# EAGLE design FTDI 1.1 (EAGLE 6.2)
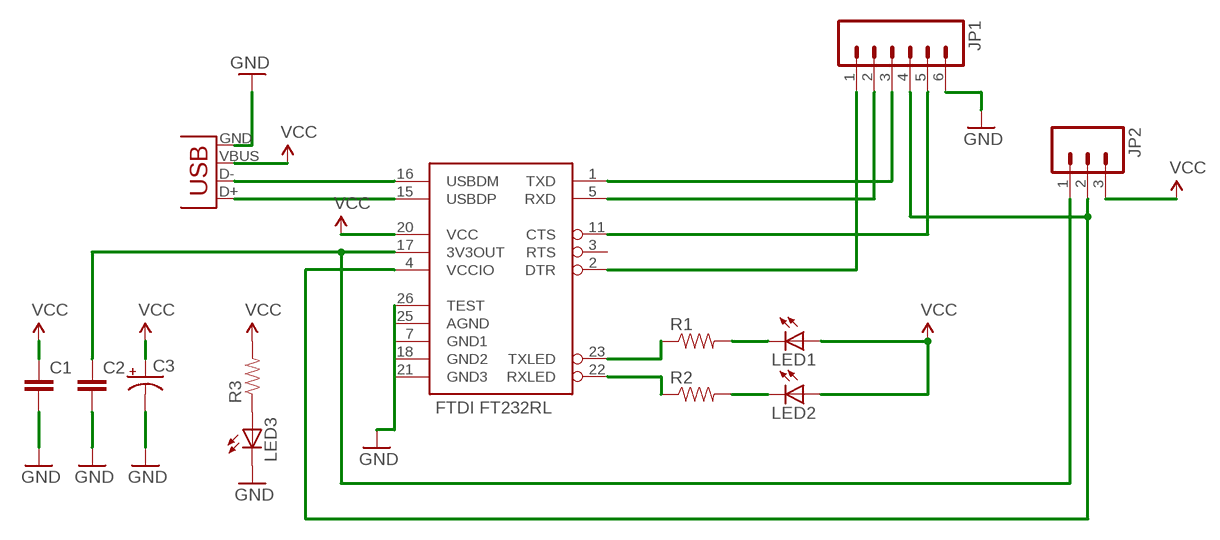
[diagram p0: schematic, sheet 1]

## Parts
C1  CAP0603-CAP  [0603-CAP]
C2  CAP0603-CAP  [0603-CAP]
C3  CAP_POL1206  [EIA3216]
JP1  M06SIP  [1X06]
JP2  M03PTH  [1X03]
LED1  LED0603  [LED-0603]
LED2  LED0603  [LED-0603]
LED3  LED0603  [LED-0603]
R1  RESISTOR0603-RES  [0603-RES]
R2  RESISTOR0603-RES  [0603-RES]
R3  RESISTOR0603-RES  [0603-RES]
U1  FT232RL-BASICSSOP  [SSOP28DB]
X1  USB-SMD-NS  [USB-MINIB-NOSTOP]

## Nets
GND: C1.2 C2.2 C3.C(-) JP1.6 LED3.C U1.7(GND1) U1.18(GND2) U1.21(GND3) U1.25(AGND) U1.26(TEST) X1.GND
N$1: U1.16(USBDM) X1.D-
N$2: R1.1 U1.23(TXLED)
N$3: LED1.C R1.2
N$4: LED2.C R2.2
N$5: R2.1 U1.22(RXLED)
N$6: U1.15(USBDP) X1.D+
N$7: JP1.1 U1.2(DTR)
N$8: JP1.2 U1.5(RXD)
N$9: JP1.3 U1.1(TXD)
N$10: JP1.5 U1.11(CTS)
N$11: JP1.4 JP2.2 U1.4(VCCIO)
N$12: C2.1 JP2.1 U1.17(3V3OUT)
N$13: LED3.A R3.1
VCC: C1.1 C3.A(+) JP2.3 LED1.A LED2.A R3.2 U1.20(VCC) X1.VBUS
Unconnected: U1.3(RTS)

## Notes on the sheet
- FTDI FT232RL

## Library data of the parts
C1 C2 = SparkFun:CAP: Capacitor Standard 0603 ceramic capacitor, and 0.1" leaded capacitor.
C3 = SparkFun:CAP_POL: Capacitor Polarized These are standard SMD and PTH capacitors. Normally 10uF, 47uF, and 100uF in electrolytic and tantalum varieties. Always verify the external diameter of the through hole cap, it varies with capacity, voltage, and manufacturer. The EIA devices should be standard.
JP1 = SparkFun:M06: Header 6 Standard 6-pin 0.1" header. Use with straight break away headers (SKU : PRT-00116), right angle break away headers (PRT-00553), swiss pins (PRT-00743), machine pins (PRT-00117), and female headers (PRT-00115). Molex polarized connector foot print use with SKU : PRT-08094 with associated crimp pins and housings. NOTES ON THE VARIANTS LOCK and LOCK_LONGPADS... This footprint was designed to help hold the alignment of a through-hole component (i.e. 6-pin header) while soldering it into place. You may notice that each hole has been shifted either up or down by 0.005 of an inch from it's more standard position (which is a perfectly straight line). This slight alteration caused the pins (the squares in the middle) to touch the edges of the holes. Because they are alternating, it causes a "brace" to hold the component in place. 0.005 has proven to be the perfect amount of "off-center" position when using our standard breakaway headers. Although looks a little odd when you look at the bare footprint, once you have a header in there, the alteration is very hard to notice. Also, if you push a header all the way into place, it is covered up entirely on the bottom side. This idea of altering the position of holes to aid alignment will be further integrated into the Sparkfun Library for other footprints. It can help hold any component with 3 or more connection pins.
JP2 = SparkFun:M03: Header 3 Standard 3-pin 0.1" header. Use with straight break away headers (SKU : PRT-00116), right angle break away headers (PRT-00553), swiss pins (PRT-00743), machine pins (PRT-00117), and female headers (PRT-00115). Molex polarized connector foot print use with SKU : PRT-08232 with associated crimp pins and housings.
LED1-LED3 = SparkFun:LED: LEDs Standard schematic elements and footprints for 5mm, 3mm, 1206, and 0603 sized LEDs. 5mm - Spark Fun Electronics SKU : COM-00529 (and others)
R1-R3 = SparkFun:RESISTOR: Resistor Basic schematic elements and footprints for 0603, 1206, and PTH resistors.
U1 = SparkFun:FT232RL-BASIC: USB UART This is the simplified version of the FT232RL unit. Only what you need, nothing you don't. Spark Fun Electronics SKU : COM-00650
X1 = SparkFun:USB: USB Connectors USB-B-PTH is fully proven SKU : PRT-00139 USB-miniB is fully proven SKU : PRT-00587 USB-A-PCB is untested. USB-A-H is throughly reviewed, but untested. Spark Fun Electronics SKU : PRT-00437 USB-B-SMT is throughly reviewed, but untested. Needs silkscreen touching up. USB-A-S has not been used/tested USB-MB-H has not been used/tested

## Board
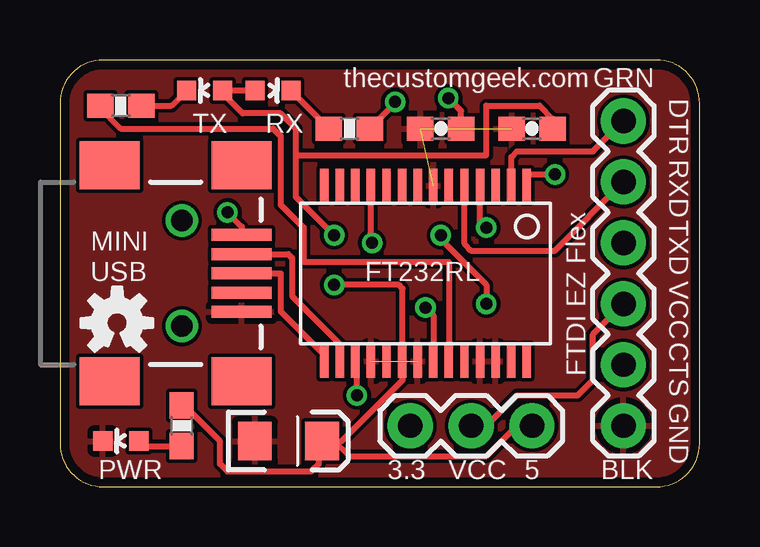
[diagram p1: board, top side]
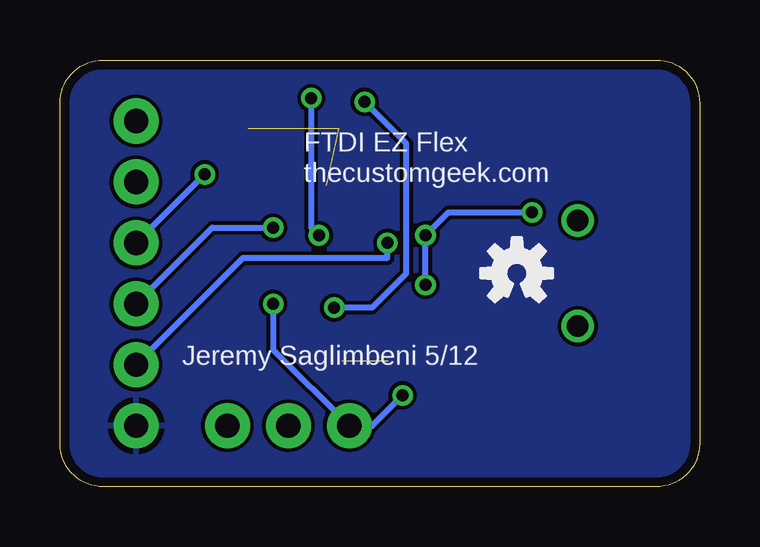
[diagram p2: board, bottom side, seen from below]

Size 26.67 x 17.78 mm. Coordinates in mm from the lower left corner, seen from the top.
Outline: 24.87,0 arc90 26.67,1.8 26.67,15.98 arc90 24.87,17.78 1.8,17.78 arc90 0,15.98 0,1.8 arc90 1.8,0 24.87,0
Copper layers (1*16): Top 0.0356mm / dielectric 1.5011mm / Bottom 0.0356mm
Design rules: minimum track width 6mil, minimum drill 13mil, track to track 6mil, track to pad 6mil, pad to pad 6mil, via to via 6mil, smd to smd 6mil, copper to edge 15mil, drill to drill 6mil, minimum pad ring 7mil, minimum via ring 7mil, stop-mask expansion 4mil, vias tented up to drill 0mil, thermal gap 10mil

### Footprints (pad centres in the part's own frame; a part is rotated, then mirrored left to right if it is on the bottom)
0603-CAP = smd 1.1 x 1: 1 -0.85,0; 2 0.85,0
EIA3216 = smd 1.4 x 1.6: A 1.4,0; C -1.4,0
1X06 = drill 1.016 pad 1.88: 1 0,0; 2 2.54,0; 3 5.08,0; 4 7.62,0; 5 10.16,0; 6 12.7,0
1X03 = drill 1.016 pad 1.88: 1 0,0; 2 2.54,0; 3 5.08,0
LED-0603 = smd 0.8 x 0.8: A 0,-0.75; C 0,0.75
0603-RES = smd 1.1 x 1: 1 -0.85,0; 2 0.85,0
SSOP28DB = smd 0.348 x 1.397: 1 -4.225,-3.656; 2 -3.575,-3.656; 3 -2.925,-3.656; 4 -2.275,-3.656; 5 -1.625,-3.656; 6 -0.975,-3.656; 7 -0.325,-3.656; 8 0.325,-3.656; 9 0.975,-3.656; 10 1.625,-3.656; 11 2.275,-3.656; 12 2.925,-3.656; 13 3.575,-3.656; 14 4.225,-3.656; 15 4.225,3.656; 16 3.575,3.656; 17 2.925,3.656; 18 2.275,3.656; 19 1.625,3.656; 20 0.975,3.656; 21 0.325,3.656; 22 -0.325,3.656; 23 -0.975,3.656; 24 -1.625,3.656; 25 -2.275,3.656; 26 -2.925,3.656; 27 -3.575,3.656; 28 -4.225,3.656
USB-MINIB-NOSTOP = smd 2.5 x 0.5: D+ 2.5,0; D- 2.5,0.8; GND 2.5,-1.6; ID 2.5,-0.8; VBUS 2.5,1.6 | smd 2.5 x 2: G1 -3,-4.5; G2 -3,4.5; G3 2.5,4.5; G4 2.5,-4.5 | drill 0.9 pad 0.8: H1 0,2.2 | drill 0.9 pad 0.787: H2 0,-2.2

### Placement (x,y rotation side)
C1  19.68,14.92 180 top
C2  15.88,14.92 180 top
C3  9.53,1.91 0 top
JP1  23.5,15.24 270 top
JP2  14.61,2.54 0 top
LED1  6.03,16.51 90 top
LED2  8.89,16.51 270 top
LED3  2.54,1.91 90 top
R1  2.54,15.88 0 top
R2  12.06,14.92 180 top
R3  5.08,2.54 90 top
U1  15.24,8.89 180 top
U$1  [OSHW-LOGO-S]  2.38,6.83 0 top
U$2  [OSHW-LOGO-S]  7.62,8.89 0 bottom
X1  5.08,8.89 0 top

### Tracks (layer width: path | path; a pad name or v marks a point on that pad's centre or on a via)
GND  (3 unrouted)
  pour Top: 24.87,0 arc90 26.67,1.8 26.67,15.98 arc90 24.87,17.78 1.8,17.78 arc90 0,15.98 0,1.8 arc90 1.8,0
  pour Bottom: 0,15.98 arc-90 1.8,17.78 24.87,17.78 arc-90 26.67,15.98 26.67,1.8 arc-90 24.87,0 1.8,0 arc-90 0,1.8
N$1
  Top 0.254: X1.D- 9.52,9.69 9.68,9.53 9.68,7.94 11.66,5.96 U1.16
N$2
  Top 0.254: R1.1 1.69,15.77 2.54,14.92 8.89,14.92 9.21,14.61 9.21,11.75 10.16,10.79 10.16,9.37 16.21,9.37 U1.23 16.19,5.26
N$3
  Top 0.254: R1.2 4.65,15.88 LED1.C
N$4
  Top 0.254: LED2.C 9.64,16.5 R2.2
N$5  (via drill 0.5)
  Top 0.254: R2.1 13.97,15.98 v13.97,16.03 | v15.24,7.46 15.56,7.14 U1.22
  Bottom 0.254: v13.97,16.03 12.22,14.29 12.22,8.89 13.65,7.46 v15.24,7.46
N$6
  Top 0.254: X1.D+ 9.21,8.89 9.21,7.3 11.02,5.5 U1.15
N$7
  Top 0.254: JP1.1 22.23,13.97 19.05,13.97 18.82,13.73 U1.2
N$8
  Top 0.254: JP1.2 20.64,9.84 17.14,9.84 16.86,10.12 U1.5
N$9  (via drill 0.5)
  Top 0.254: v20.64,13.02 19.46,13.02 U1.1
  Bottom 0.254: v20.64,13.02 JP1.3
N$10  (via drill 0.5)
  Top 0.254: v13.02,10.16 12.96,10.21 U1.11
  Bottom 0.254: JP1.5 19.05,9.53 13.02,9.53 v13.02,10.16
N$11  (via drill 0.5)
  Top 0.254: JP2.2 17.78,2.54 19.05,3.81 21.59,3.81 22.23,4.45 22.23,6.35 JP1.4 | v17.78,10.79 17.52,11.06 U1.4
  Bottom 0.254: JP1.4 20.32,10.79 v17.78,10.79
N$12  (via drill 0.5)
  Top 0.254: U1.17 12.38,5.17 v12.38,3.81 | C2.1 16.73,15.66 v16.19,16.19 | v15.88,10.48 15.88,10.32 17.78,8.41 v17.78,7.62
  Bottom 0.254: v12.38,3.81 13.65,2.54 JP2.1 17.78,5.71 v17.78,7.62 | v16.19,16.19 16.19,10.79 v15.88,10.48
N$13
  Top 0.254: R3.1 3.5,1.69 LED3.A
VCC  (via drill 0.5)
  Top 0.254: LED2.A LED1.A 6.78,16.39 7.62,15.56 9.21,15.56 9.84,14.92 9.84,13.81 | 9.84,13.81 9.84,12.06 v11.43,10.48 | X1.VBUS 7.58,10.84 v6.99,11.43 | C1.1 20.54,15.34 20,15.88 17.78,15.88 17.78,13.81 9.84,13.81 | R3.2 5.18,3.39 6.67,1.91 6.67,0.95 6.99,0.64 10.48,0.64 10.79,0.95 10.79,1.77 C3.A 11.43,1.91 | 11.43,1.91 11.75,1.91 14.29,4.45 14.29,5.21 U1.20 14.29,5.26 14.29,8.26 14.13,8.41 v11.43,8.41 | JP2.3 19.05,2.54 17.78,1.27 12.06,1.27 11.43,1.91
  Bottom 0.254: v11.43,8.41 v11.43,10.48 10.48,11.43 v6.99,11.43

### Text on the board
tPlace: thecustomgeek.com | GRN | TX | RX | DTR | RXD | TXD | MINI | USB | FT232RL | VCC | CTS | FTDI EZ Flex | GND | PWR | 3.3 | VCC | 5 | BLK
bPlace: FTDI EZ Flex | thecustomgeek.com | Jeremy Saglimbeni 5/12